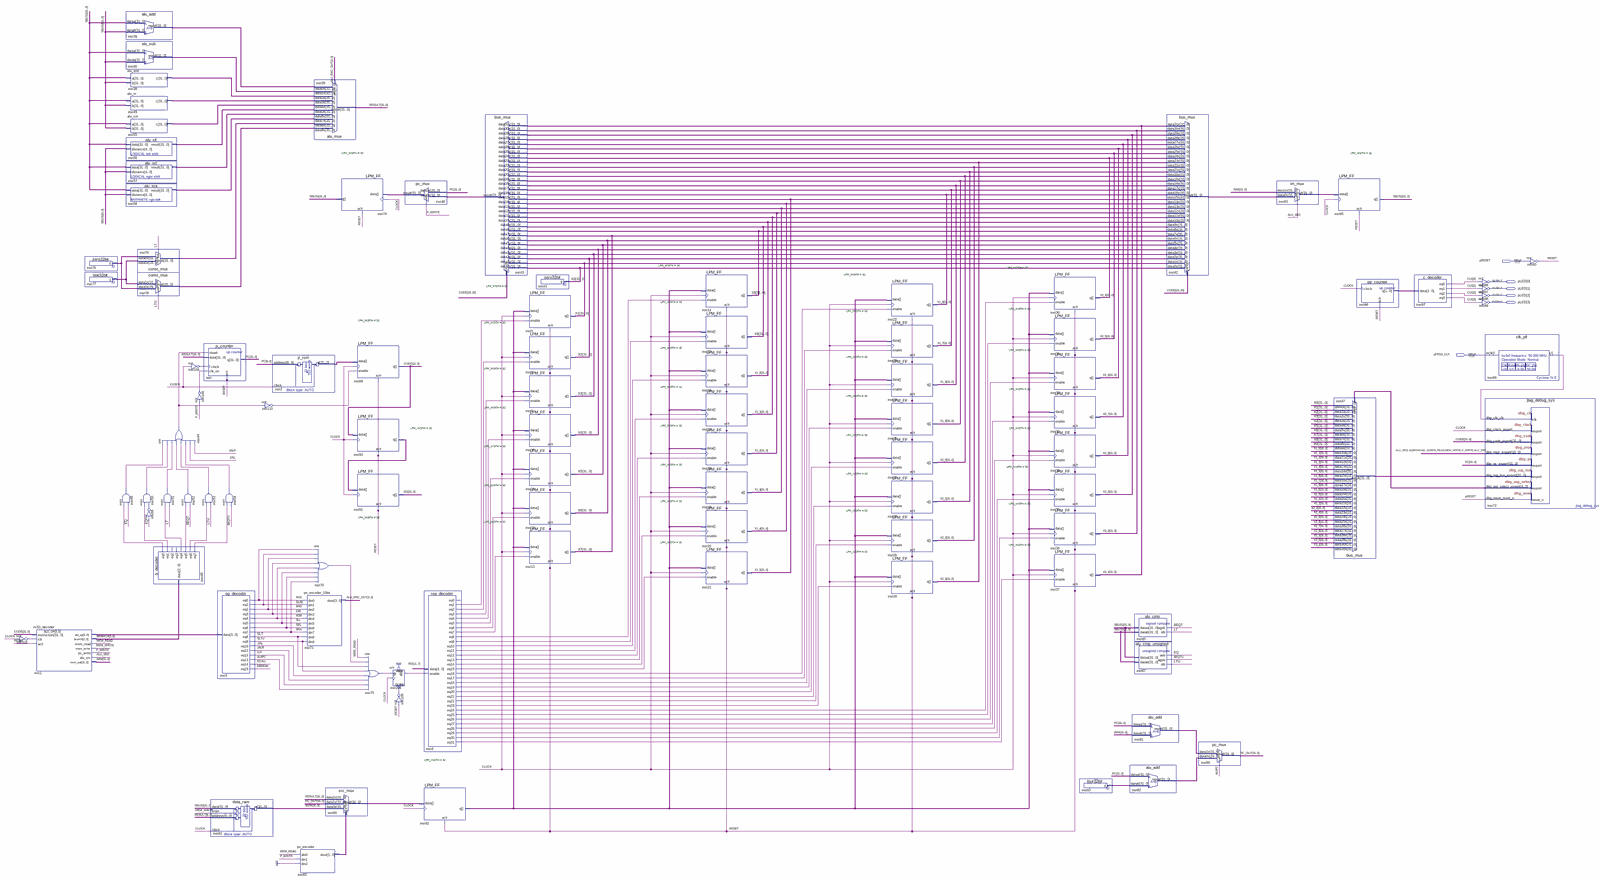
[diagram p0: schematic sheet, whole]
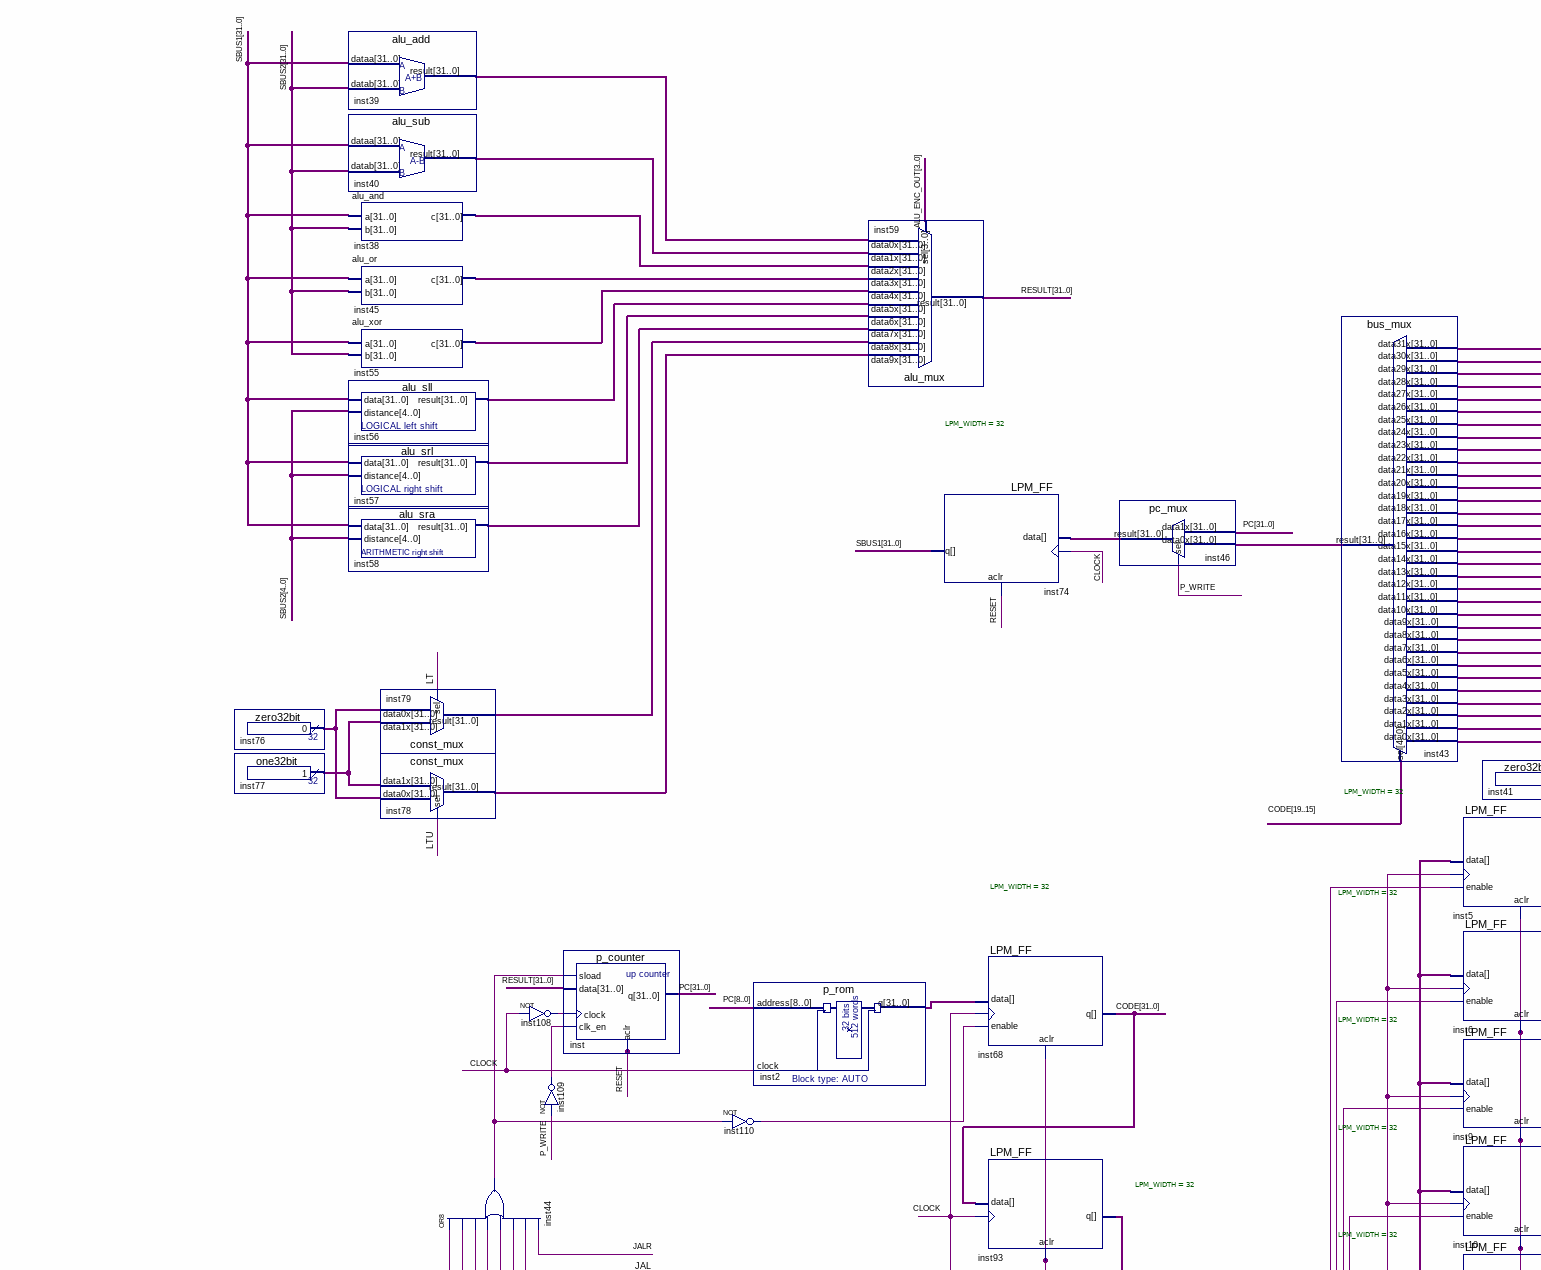
[diagram p1: schematic sheet, upper left part]
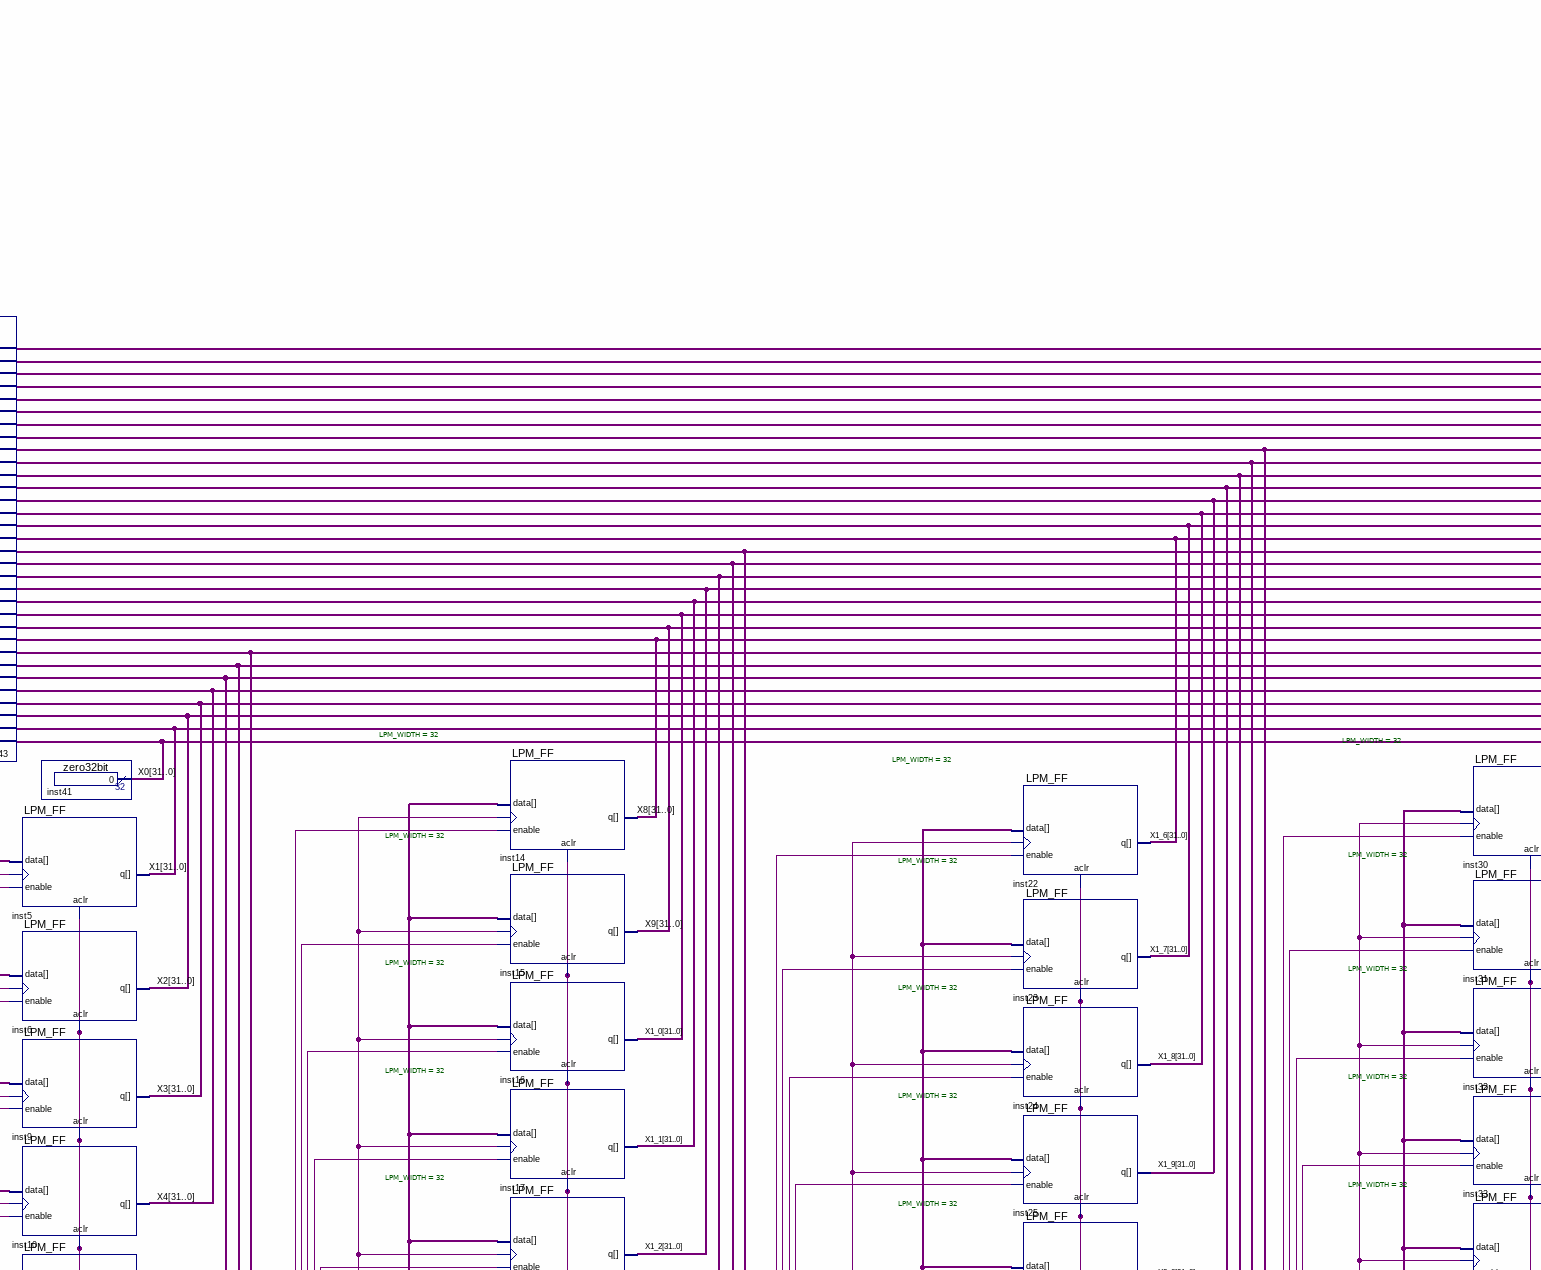
[diagram p2: schematic sheet, upper centre part]
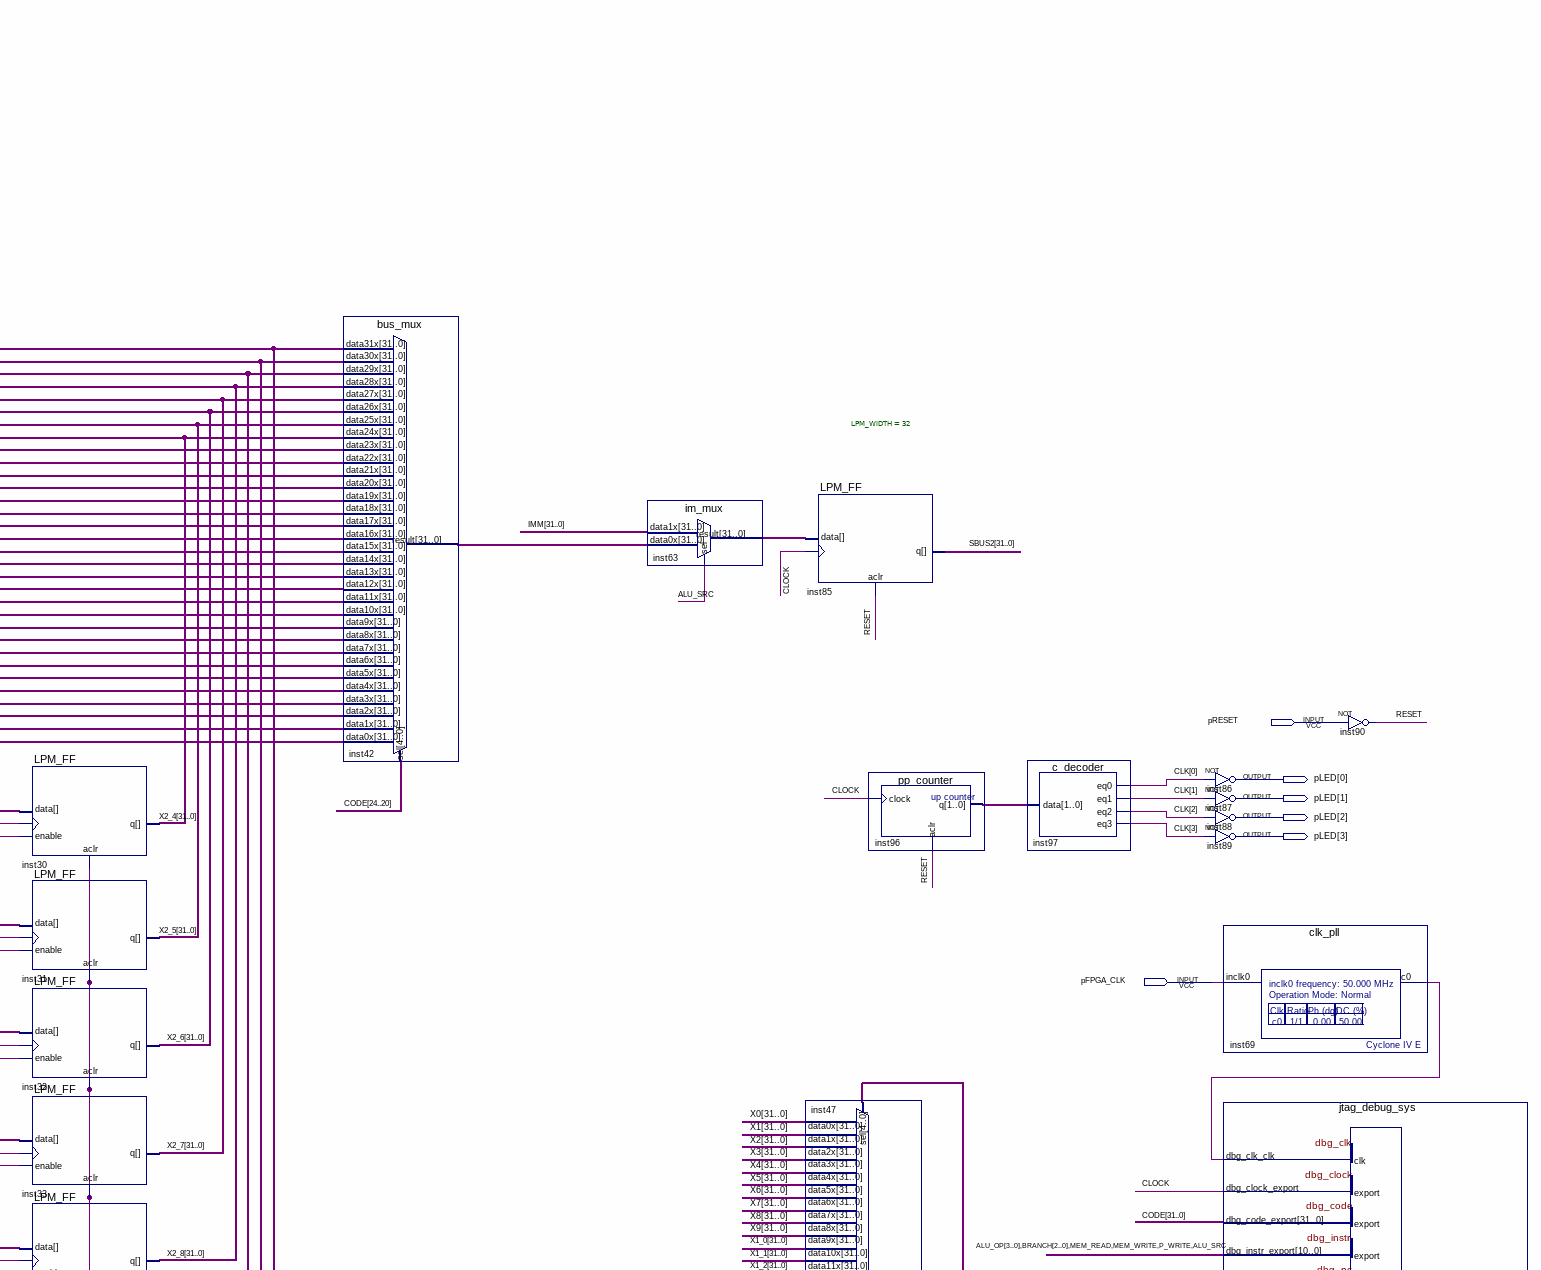
[diagram p3: schematic sheet, upper right part]
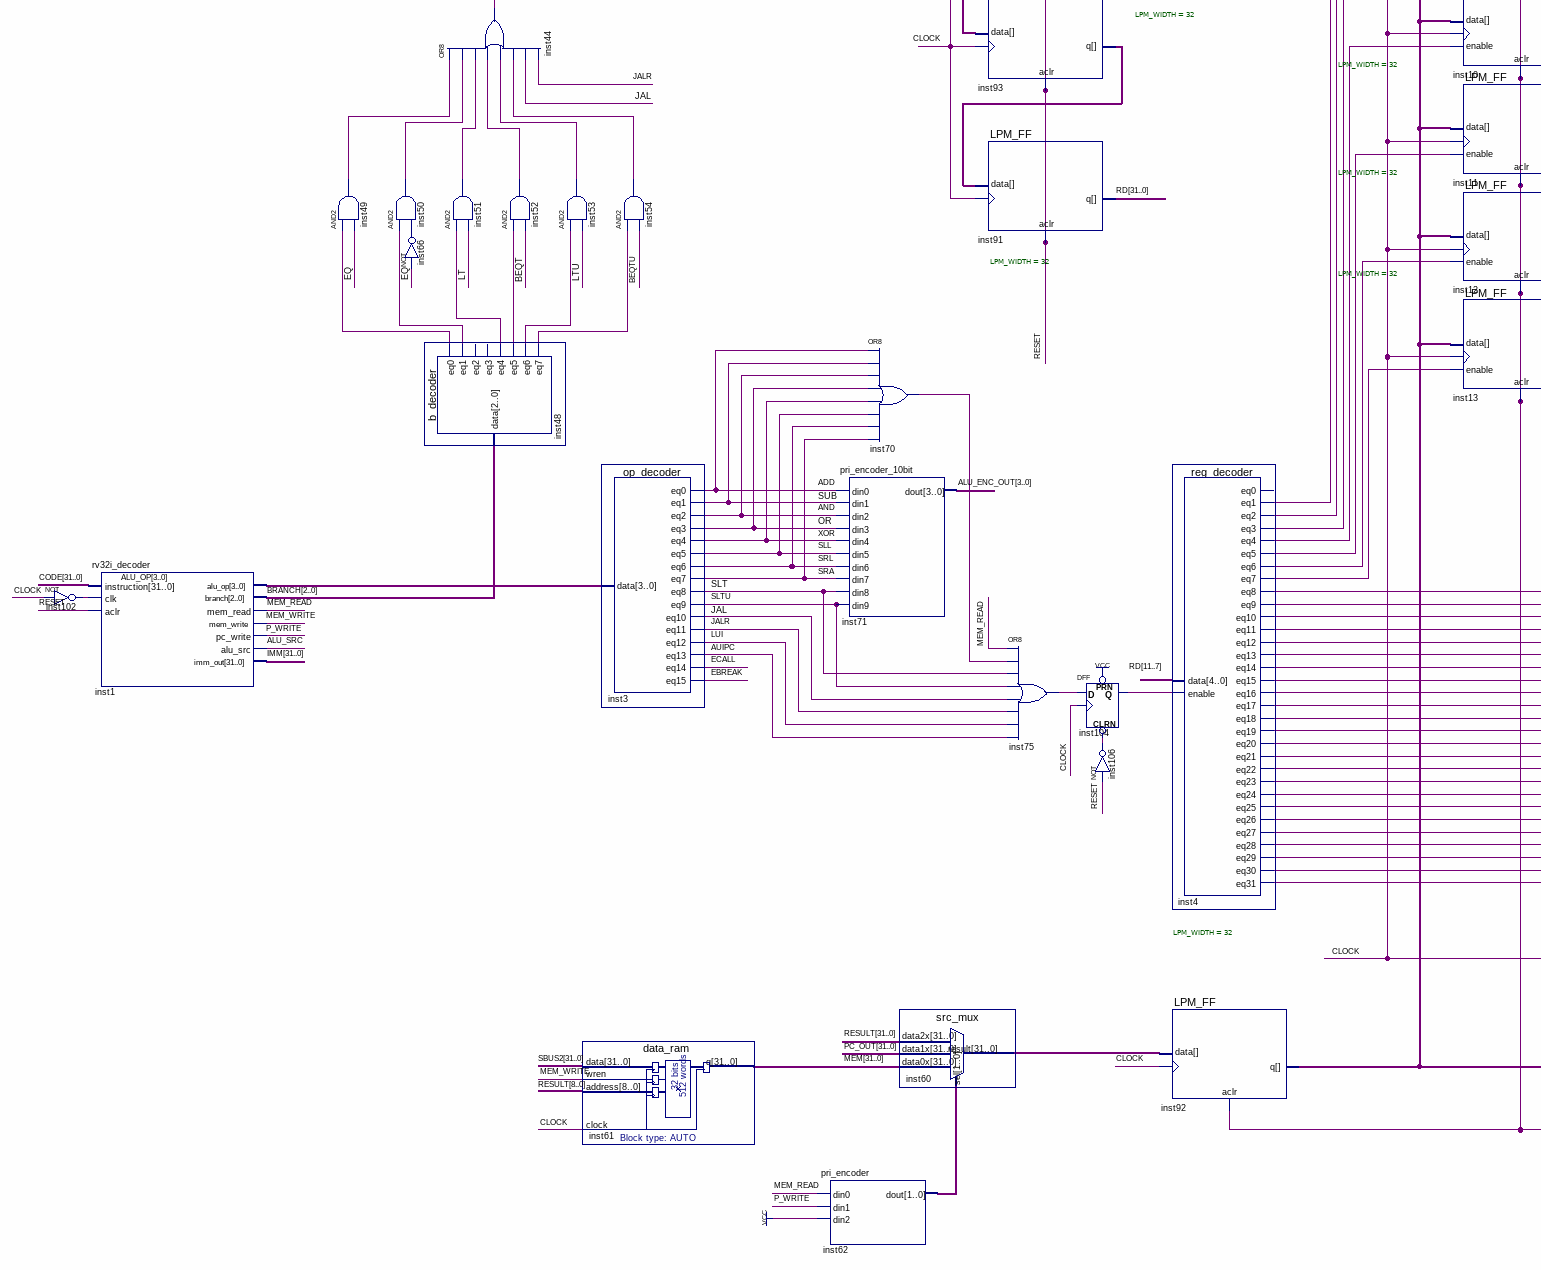
[diagram p4: schematic sheet, lower left part]
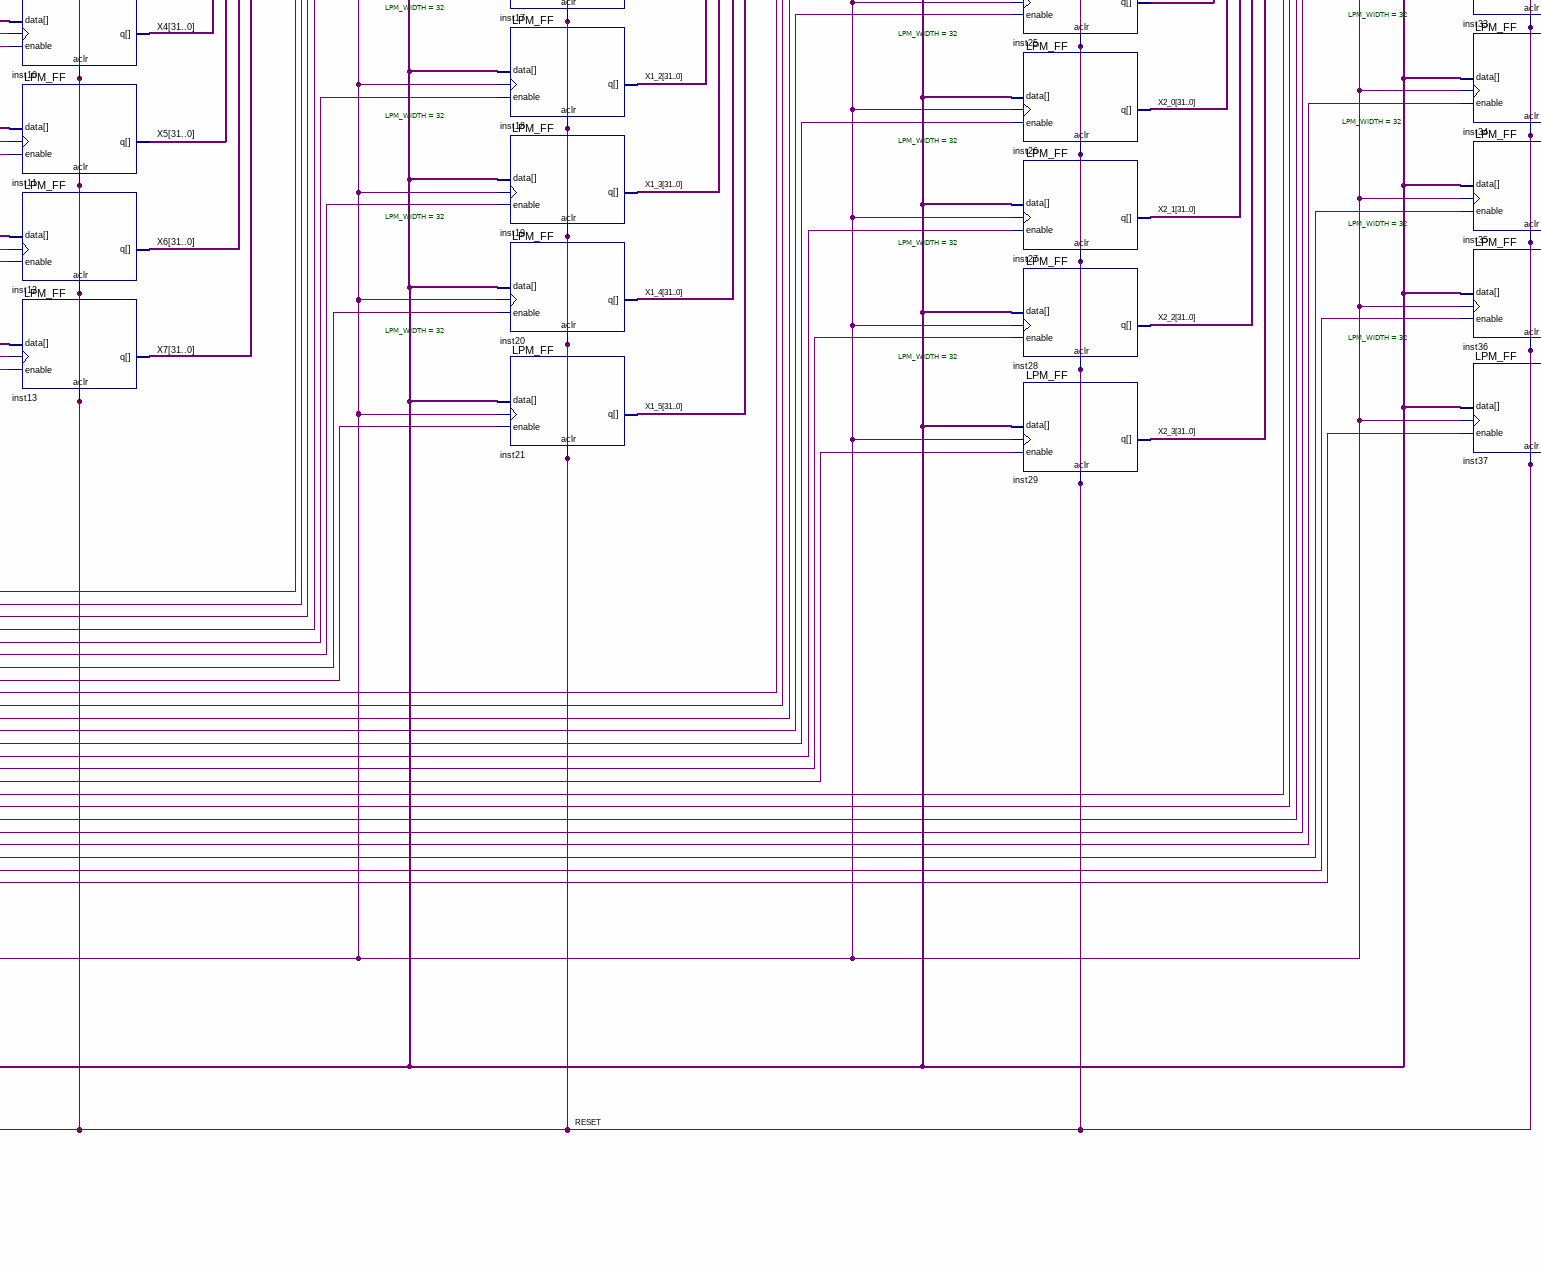
[diagram p5: schematic sheet, lower centre part]
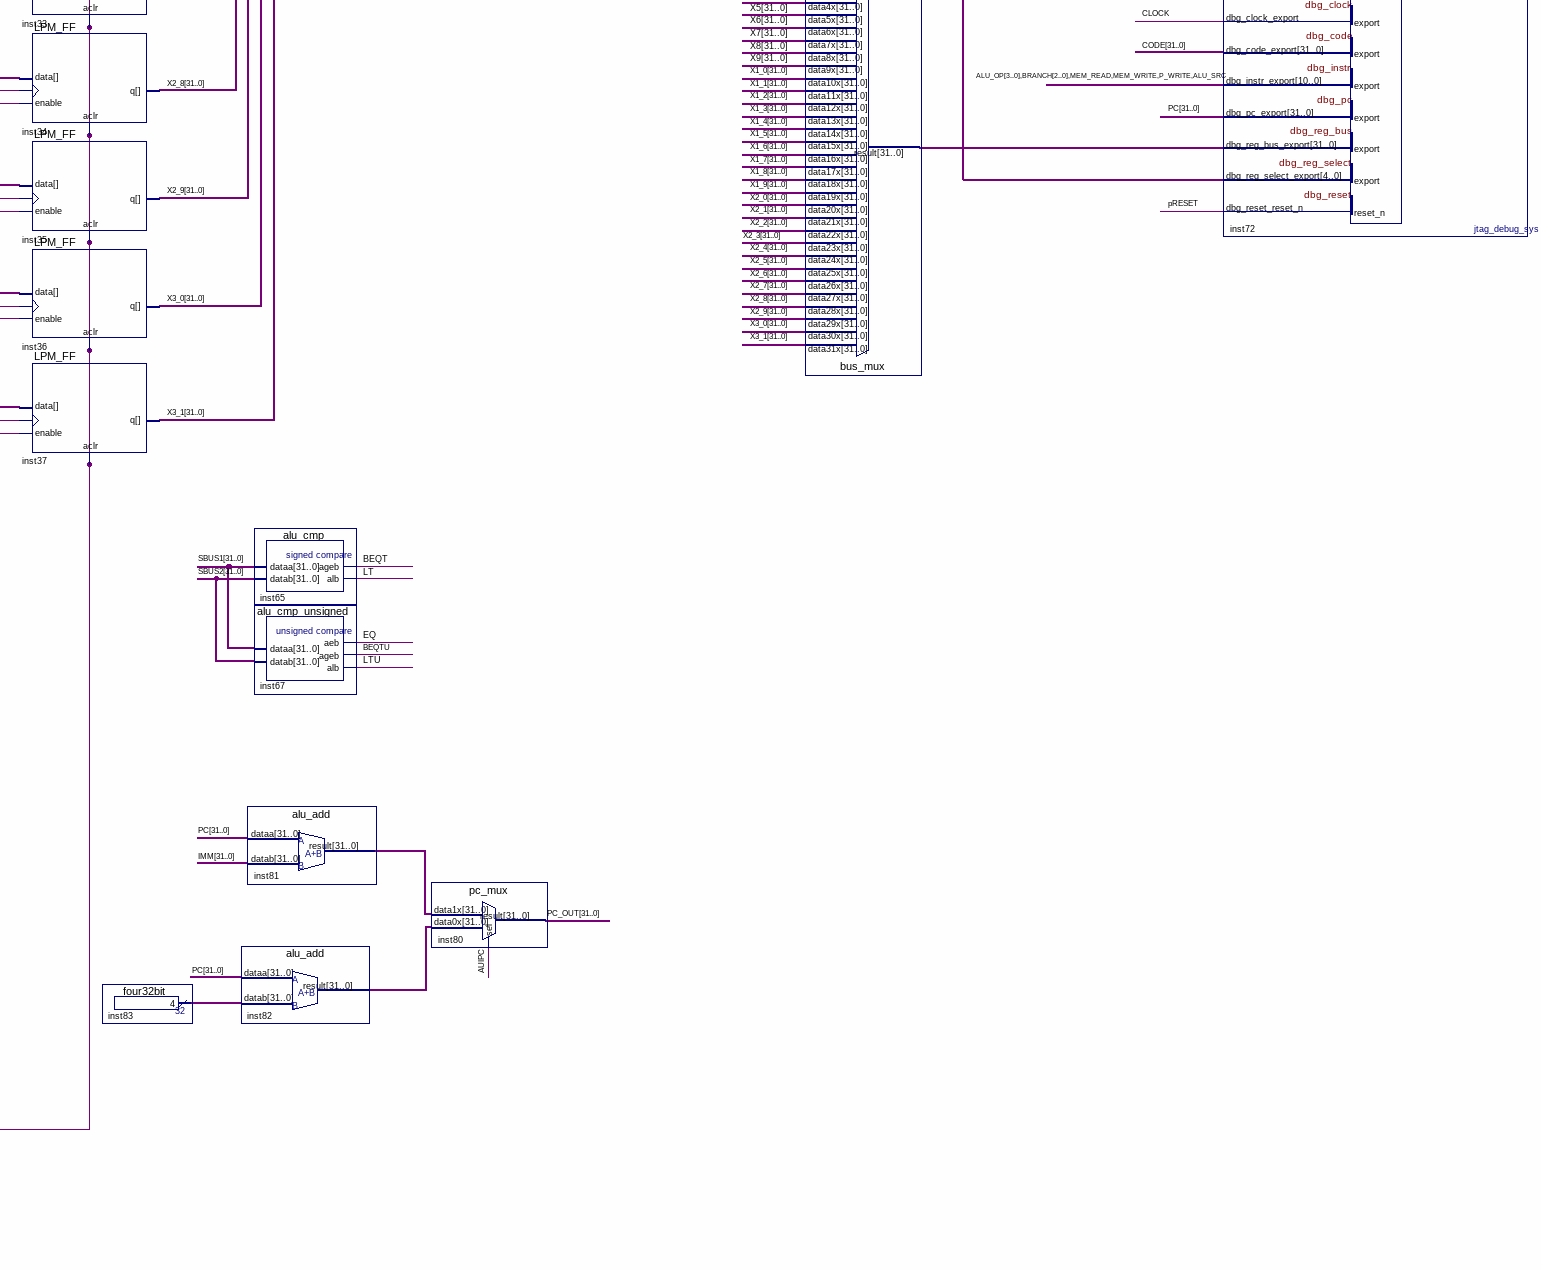
[diagram p6: schematic sheet, lower right part]
// Quartus schematic forest-risc-v.bdf as structural Verilog: 97 symbols, 6 pins
module \forest-risc-v  (
  input  pRESET,
  input  pFPGA_CLK,
  output [3:0] pLED
);

  wire ADD, ALU_SRC, AND, AUIPC, BEQT, BEQTU, CLOCK, EBREAK, ECALL, EQ, inst4_eq1, inst4_eq2, inst4_eq3,
       inst4_eq4, inst4_eq5, inst4_eq6, inst4_eq7, inst4_eq8, inst4_eq9, inst4_eq10, inst4_eq11, inst4_eq12,
       inst4_eq13, inst4_eq14, inst4_eq15, inst4_eq16, inst4_eq17, inst4_eq18, inst4_eq19, inst4_eq20,
       inst4_eq21, inst4_eq22, inst4_eq23, inst4_eq24, inst4_eq25, inst4_eq26, inst4_eq27, inst4_eq28,
       inst4_eq29, inst4_eq30, inst4_eq31, inst44_out, inst48_eq0, inst48_eq1, inst48_eq4, inst48_eq5,
       inst48_eq6, inst48_eq7, inst49_out, inst50_out, inst51_out, inst52_out, inst53_out, inst54_out,
       inst66_out, inst69_c0, inst70_out, inst75_out, inst102_out, inst104_q, inst106_out, inst108_out,
       inst109_out, inst110_out, JAL, JALR, LT, LTU, LUI, MEM_READ, MEM_WRITE, OR, P_WRITE, RESET, SLL, SLT,
       SLTU, SRA, SRL, SUB, XOR;
  wire [1:0] inst62_dout, inst96_q;
  wire [2:0] BRANCH;
  wire [3:0] ALU_ENC_OUT, ALU_OP, CLK;
  wire [4:0] inst72_dbg_reg_select_export;
  wire [31:0] CODE, IMM, inst2_q, inst38_c, inst39_result, inst40_result, inst42_result, inst43_result,
       inst45_c, inst46_result, inst47_result, inst55_c, inst56_result, inst57_result, inst58_result,
       inst60_result, inst63_result, inst76_result, inst77_result, inst78_result, inst79_result,
       inst81_result, inst82_result, inst83_result, inst92_q, inst93_q, MEM, PC, PC_OUT, RD, RESULT, SBUS1,
       SBUS2, X0, X1, X1_0, X1_1, X1_2, X1_3, X1_4, X1_5, X1_6, X1_7, X1_8, X1_9, X2, X2_0, X2_1, X2_2, X2_3,
       X2_4, X2_5, X2_6, X2_7, X2_8, X2_9, X3, X3_0, X3_1, X4, X5, X6, X7, X8, X9;

  not inst102 (inst102_out, CLOCK);
  rv32i_decoder inst1 (
    .instruction(CODE), .clk(inst102_out), .aclr(RESET), .alu_op(ALU_OP), .branch(BRANCH),
    .mem_read(MEM_READ), .mem_write(MEM_WRITE), .pc_write(P_WRITE), .alu_src(ALU_SRC), .imm_out(IMM));
  zero32bit inst76 (.result(inst76_result));
  one32bit inst77 (.result(inst77_result));
  alu_add inst39 (.dataa(SBUS1), .datab(SBUS2), .result(inst39_result));
  alu_sub inst40 (.dataa(SBUS1), .datab(SBUS2), .result(inst40_result));
  alu_and inst38 (.a(SBUS1), .b(SBUS2), .c(inst38_c));
  alu_or inst45 (.a(SBUS1), .b(SBUS2), .c(inst45_c));
  alu_xor inst55 (.a(SBUS1), .b(SBUS2), .c(inst55_c));
  alu_sll inst56 (.data(SBUS1), .distance(SBUS2[4:0]), .result(inst56_result));
  alu_srl inst57 (.data(SBUS1), .distance(SBUS2[4:0]), .result(inst57_result));
  alu_sra inst58 (.data(SBUS1), .distance(SBUS2[4:0]), .result(inst58_result));
  and inst49 (inst49_out, inst48_eq0, EQ);
  const_mux inst79 (.data1x(inst77_result), .data0x(inst76_result), .sel(LT), .result(inst79_result));
  const_mux inst78 (.data1x(inst77_result), .data0x(inst76_result), .sel(LTU), .result(inst78_result));
  and inst50 (inst50_out, inst48_eq1, inst66_out);
  not inst66 (inst66_out, EQ);
  or inst44 (inst44_out, inst49_out, inst50_out, inst51_out, inst52_out, inst53_out, inst54_out, JAL, JALR);
  and inst51 (inst51_out, inst48_eq4, LT);
  b_decoder inst48 (
    .data(BRANCH), .eq0(inst48_eq0), .eq1(inst48_eq1), .eq4(inst48_eq4), .eq5(inst48_eq5), .eq6(inst48_eq6),
    .eq7(inst48_eq7));  // open: eq2, eq3
  and inst52 (inst52_out, inst48_eq5, BEQT);
  p_counter inst (.sload(inst44_out), .data(RESULT), .clock(inst108_out), .clk_en(inst109_out), .aclr(RESET), .q(PC));
  not inst108 (inst108_out, CLOCK);
  not inst109 (inst109_out, P_WRITE);
  and inst53 (inst53_out, inst48_eq6, LTU);
  and inst54 (inst54_out, inst48_eq7, BEQTU);
  op_decoder inst3 (
    .data(ALU_OP), .eq0(ADD), .eq1(SUB), .eq2(AND), .eq3(OR), .eq4(XOR), .eq5(SLL), .eq6(SRL), .eq7(SRA),
    .eq8(SLT), .eq9(SLTU), .eq10(JAL), .eq11(JALR), .eq12(LUI), .eq13(AUIPC), .eq14(ECALL), .eq15(EBREAK));
  data_ram inst61 (.data(SBUS2), .wren(MEM_WRITE), .address(RESULT[8:0]), .clock(CLOCK), .q(MEM));
  p_rom inst2 (.address(PC[8:0]), .clock(CLOCK), .q(inst2_q));
  not inst110 (inst110_out, inst44_out);
  pri_encoder inst62 (.din0(MEM_READ), .din1(P_WRITE), .din2(1'b1), .dout(inst62_dout));
  alu_mux inst59 (
    .data9x(inst78_result), .data8x(inst79_result), .data7x(inst58_result), .data6x(inst57_result),
    .data5x(inst56_result), .data4x(inst55_c), .data3x(inst45_c), .data2x(inst38_c), .data1x(inst40_result),
    .data0x(inst39_result), .sel(ALU_ENC_OUT), .result(RESULT));
  or inst70 (inst70_out, ADD, SUB, AND, OR, XOR, SLL, SRL, SRA);
  pri_encoder_10bit inst71 (
    .din0(ADD), .din1(SUB), .din2(AND), .din3(OR), .din4(XOR), .din5(SLL), .din6(SRL), .din7(SRA),
    .din8(SLT), .din9(SLTU), .dout(ALU_ENC_OUT));
  src_mux inst60 (.data2x(RESULT), .data1x(PC_OUT), .data0x(MEM), .sel(inst62_dout), .result(inst60_result));
  LPM_FF #(.LPM_WIDTH(32)) inst74 (.aclr(RESET), .clock(CLOCK), .data(inst46_result), .q(SBUS1));
  LPM_FF #(.LPM_WIDTH(32)) inst68 (.aclr(RESET), .clock(CLOCK), .data(inst2_q), .enable(inst110_out), .q(CODE));
  LPM_FF #(.LPM_WIDTH(32)) inst93 (.aclr(RESET), .clock(CLOCK), .data(CODE), .q(inst93_q));
  LPM_FF #(.LPM_WIDTH(32)) inst91 (.aclr(RESET), .clock(CLOCK), .data(inst93_q), .q(RD));
  or inst75 (inst75_out, MEM_READ, inst70_out, SLT, SLTU, JAL, JALR, LUI, AUIPC);
  pc_mux inst46 (.data1x(PC), .data0x(inst43_result), .sel(P_WRITE), .result(inst46_result));
  DFF inst104 (.CLRN(inst106_out), .CLK(CLOCK), .D(inst75_out), .PRN(1'b1), .Q(inst104_q));
  not inst106 (inst106_out, RESET);
  reg_decoder inst4 (
    .data(RD[11:7]), .enable(inst104_q), .eq1(inst4_eq1), .eq2(inst4_eq2), .eq3(inst4_eq3), .eq4(inst4_eq4),
    .eq5(inst4_eq5), .eq6(inst4_eq6), .eq7(inst4_eq7), .eq8(inst4_eq8), .eq9(inst4_eq9), .eq10(inst4_eq10),
    .eq11(inst4_eq11), .eq12(inst4_eq12), .eq13(inst4_eq13), .eq14(inst4_eq14), .eq15(inst4_eq15),
    .eq16(inst4_eq16), .eq17(inst4_eq17), .eq18(inst4_eq18), .eq19(inst4_eq19), .eq20(inst4_eq20),
    .eq21(inst4_eq21), .eq22(inst4_eq22), .eq23(inst4_eq23), .eq24(inst4_eq24), .eq25(inst4_eq25),
    .eq26(inst4_eq26), .eq27(inst4_eq27), .eq28(inst4_eq28), .eq29(inst4_eq29), .eq30(inst4_eq30),
    .eq31(inst4_eq31));  // open: eq0
  LPM_FF #(.LPM_WIDTH(32)) inst92 (.aclr(RESET), .clock(CLOCK), .data(inst60_result), .q(inst92_q));
  bus_mux inst43 (
    .data31x(X3_1), .data30x(X3_0), .data29x(X2_9), .data28x(X2_8), .data27x(X2_7), .data26x(X2_6),
    .data25x(X2_5), .data24x(X2_4), .data23x(X2_3), .data22x(X2_2), .data21x(X2_1), .data20x(X2_0),
    .data19x(X1_9), .data18x(X1_8), .data17x(X1_7), .data16x(X1_6), .data15x(X1_5), .data14x(X1_4),
    .data13x(X1_3), .data12x(X1_2), .data11x(X1_1), .data10x(X1_0), .data9x(X9), .data8x(X8), .data7x(X7),
    .data6x(X6), .data5x(X5), .data4x(X4), .data3x(X3), .data2x(X2), .data1x(X1), .data0x(X0),
    .sel(CODE[19:15]), .result(inst43_result));
  LPM_FF #(.LPM_WIDTH(32)) inst5 (.aclr(RESET), .clock(CLOCK), .data(inst92_q), .enable(inst4_eq1), .q(X1));
  LPM_FF #(.LPM_WIDTH(32)) inst6 (.aclr(RESET), .clock(CLOCK), .data(inst92_q), .enable(inst4_eq2), .q(X2));
  LPM_FF #(.LPM_WIDTH(32)) inst9 (.aclr(RESET), .clock(CLOCK), .data(inst92_q), .enable(inst4_eq3), .q(X3));
  LPM_FF #(.LPM_WIDTH(32)) inst10 (.aclr(RESET), .clock(CLOCK), .data(inst92_q), .enable(inst4_eq4), .q(X4));
  LPM_FF #(.LPM_WIDTH(32)) inst11 (.aclr(RESET), .clock(CLOCK), .data(inst92_q), .enable(inst4_eq5), .q(X5));
  LPM_FF #(.LPM_WIDTH(32)) inst12 (.aclr(RESET), .clock(CLOCK), .data(inst92_q), .enable(inst4_eq6), .q(X6));
  LPM_FF #(.LPM_WIDTH(32)) inst13 (.aclr(RESET), .clock(CLOCK), .data(inst92_q), .enable(inst4_eq7), .q(X7));
  zero32bit inst41 (.result(X0));
  LPM_FF #(.LPM_WIDTH(32)) inst14 (.aclr(RESET), .clock(CLOCK), .data(inst92_q), .enable(inst4_eq8), .q(X8));
  LPM_FF #(.LPM_WIDTH(32)) inst15 (.aclr(RESET), .clock(CLOCK), .data(inst92_q), .enable(inst4_eq9), .q(X9));
  LPM_FF #(.LPM_WIDTH(32)) inst16 (.aclr(RESET), .clock(CLOCK), .data(inst92_q), .enable(inst4_eq10), .q(X1_0));
  LPM_FF #(.LPM_WIDTH(32)) inst17 (.aclr(RESET), .clock(CLOCK), .data(inst92_q), .enable(inst4_eq11), .q(X1_1));
  LPM_FF #(.LPM_WIDTH(32)) inst18 (.aclr(RESET), .clock(CLOCK), .data(inst92_q), .enable(inst4_eq12), .q(X1_2));
  LPM_FF #(.LPM_WIDTH(32)) inst19 (.aclr(RESET), .clock(CLOCK), .data(inst92_q), .enable(inst4_eq13), .q(X1_3));
  LPM_FF #(.LPM_WIDTH(32)) inst20 (.aclr(RESET), .clock(CLOCK), .data(inst92_q), .enable(inst4_eq14), .q(X1_4));
  LPM_FF #(.LPM_WIDTH(32)) inst21 (.aclr(RESET), .clock(CLOCK), .data(inst92_q), .enable(inst4_eq15), .q(X1_5));
  LPM_FF #(.LPM_WIDTH(32)) inst22 (.aclr(RESET), .clock(CLOCK), .data(inst92_q), .enable(inst4_eq16), .q(X1_6));
  LPM_FF #(.LPM_WIDTH(32)) inst23 (.aclr(RESET), .clock(CLOCK), .data(inst92_q), .enable(inst4_eq17), .q(X1_7));
  LPM_FF #(.LPM_WIDTH(32)) inst24 (.aclr(RESET), .clock(CLOCK), .data(inst92_q), .enable(inst4_eq18), .q(X1_8));
  LPM_FF #(.LPM_WIDTH(32)) inst25 (.aclr(RESET), .clock(CLOCK), .data(inst92_q), .enable(inst4_eq19), .q(X1_9));
  LPM_FF #(.LPM_WIDTH(32)) inst26 (.aclr(RESET), .clock(CLOCK), .data(inst92_q), .enable(inst4_eq20), .q(X2_0));
  LPM_FF #(.LPM_WIDTH(32)) inst27 (.aclr(RESET), .clock(CLOCK), .data(inst92_q), .enable(inst4_eq21), .q(X2_1));
  LPM_FF #(.LPM_WIDTH(32)) inst28 (.aclr(RESET), .clock(CLOCK), .data(inst92_q), .enable(inst4_eq22), .q(X2_2));
  LPM_FF #(.LPM_WIDTH(32)) inst29 (.aclr(RESET), .clock(CLOCK), .data(inst92_q), .enable(inst4_eq23), .q(X2_3));
  LPM_FF #(.LPM_WIDTH(32)) inst30 (.aclr(RESET), .clock(CLOCK), .data(inst92_q), .enable(inst4_eq24), .q(X2_4));
  LPM_FF #(.LPM_WIDTH(32)) inst31 (.aclr(RESET), .clock(CLOCK), .data(inst92_q), .enable(inst4_eq25), .q(X2_5));
  LPM_FF #(.LPM_WIDTH(32)) inst32 (.aclr(RESET), .clock(CLOCK), .data(inst92_q), .enable(inst4_eq26), .q(X2_6));
  LPM_FF #(.LPM_WIDTH(32)) inst33 (.aclr(RESET), .clock(CLOCK), .data(inst92_q), .enable(inst4_eq27), .q(X2_7));
  LPM_FF #(.LPM_WIDTH(32)) inst34 (.aclr(RESET), .clock(CLOCK), .data(inst92_q), .enable(inst4_eq28), .q(X2_8));
  LPM_FF #(.LPM_WIDTH(32)) inst35 (.aclr(RESET), .clock(CLOCK), .data(inst92_q), .enable(inst4_eq29), .q(X2_9));
  LPM_FF #(.LPM_WIDTH(32)) inst36 (.aclr(RESET), .clock(CLOCK), .data(inst92_q), .enable(inst4_eq30), .q(X3_0));
  LPM_FF #(.LPM_WIDTH(32)) inst37 (.aclr(RESET), .clock(CLOCK), .data(inst92_q), .enable(inst4_eq31), .q(X3_1));
  four32bit inst83 (.result(inst83_result));
  alu_cmp inst65 (.dataa(SBUS1), .datab(SBUS2), .ageb(BEQT), .alb(LT));
  alu_cmp_unsigned inst67 (.dataa(SBUS1), .datab(SBUS2), .aeb(EQ), .ageb(BEQTU), .alb(LTU));
  alu_add inst81 (.dataa(PC), .datab(IMM), .result(inst81_result));
  alu_add inst82 (.dataa(PC), .datab(inst83_result), .result(inst82_result));
  bus_mux inst42 (
    .data31x(X3_1), .data30x(X3_0), .data29x(X2_9), .data28x(X2_8), .data27x(X2_7), .data26x(X2_6),
    .data25x(X2_5), .data24x(X2_4), .data23x(X2_3), .data22x(X2_2), .data21x(X2_1), .data20x(X2_0),
    .data19x(X1_9), .data18x(X1_8), .data17x(X1_7), .data16x(X1_6), .data15x(X1_5), .data14x(X1_4),
    .data13x(X1_3), .data12x(X1_2), .data11x(X1_1), .data10x(X1_0), .data9x(X9), .data8x(X8), .data7x(X7),
    .data6x(X6), .data5x(X5), .data4x(X4), .data3x(X3), .data2x(X2), .data1x(X1), .data0x(X0),
    .sel(CODE[24:20]), .result(inst42_result));
  pc_mux inst80 (.data1x(inst81_result), .data0x(inst82_result), .sel(AUIPC), .result(PC_OUT));
  im_mux inst63 (.data1x(IMM), .data0x(inst42_result), .sel(ALU_SRC), .result(inst63_result));
  LPM_FF #(.LPM_WIDTH(32)) inst85 (.aclr(RESET), .clock(CLOCK), .data(inst63_result), .q(SBUS2));
  bus_mux inst47 (
    .data31x(X3_1), .data30x(X3_0), .data29x(X2_9), .data28x(X2_8), .data27x(X2_7), .data26x(X2_6),
    .data25x(X2_5), .data24x(X2_4), .data23x(X2_3), .data22x(X2_2), .data21x(X2_1), .data20x(X2_0),
    .data19x(X1_9), .data18x(X1_8), .data17x(X1_7), .data16x(X1_6), .data15x(X1_5), .data14x(X1_4),
    .data13x(X1_3), .data12x(X1_2), .data11x(X1_1), .data10x(X1_0), .data9x(X9), .data8x(X8), .data7x(X7),
    .data6x(X6), .data5x(X5), .data4x(X4), .data3x(X3), .data2x(X2), .data1x(X1), .data0x(X0),
    .sel(inst72_dbg_reg_select_export), .result(inst47_result));
  pp_counter inst96 (.clock(CLOCK), .aclr(RESET), .q(inst96_q));
  c_decoder inst97 (.data(inst96_q), .eq0(CLK[0]), .eq1(CLK[1]), .eq2(CLK[2]), .eq3(CLK[3]));
  not inst86 (pLED[0], CLK[0]);
  not inst87 (pLED[1], CLK[1]);
  not inst88 (pLED[2], CLK[2]);
  not inst89 (pLED[3], CLK[3]);
  clk_pll inst69 (.inclk0(pFPGA_CLK), .c0(inst69_c0));
  jtag_debug_sys inst72 (
    .dbg_clk_clk(inst69_c0), .dbg_code_export(CODE),
    .dbg_instr_export({ALU_OP, BRANCH, MEM_READ, MEM_WRITE, P_WRITE, ALU_SRC}), .dbg_pc_export(PC),
    .dbg_reg_bus_export(inst47_result), .dbg_reset_reset_n(pRESET), .dbg_clock_export(CLOCK),
    .dbg_reg_select_export(inst72_dbg_reg_select_export));
  not inst90 (RESET, pRESET);
endmodule
